# Altium schematic sheet Thermocouple channel.SchDoc
size A4
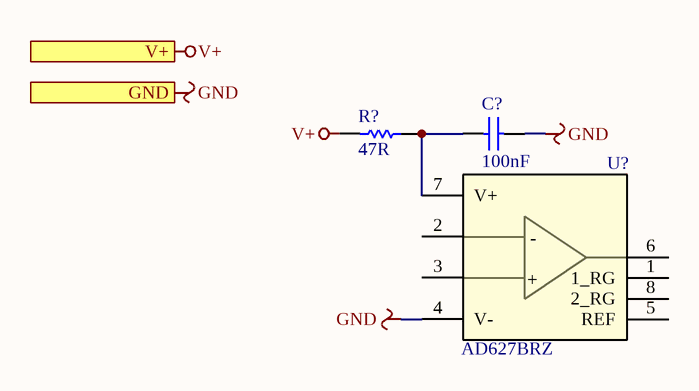
[diagram p0: Thermocouple channel.SchDoc]

## Parts
C?  100nF  [S0603C]
R?  47R  [S0603R]
U?  AD627BRZ  [SOP-8_150mil]

## Ports
GND, V+

## Nets
GND: C?.1 U?.4(V-) ; port GND
V+: R?.2 ; port V+
NetC?_2: C?.2 R?.1 U?.7(V+)

Not connected (* = marked no-connect by the designer): U? 1(1_RG) 2(VIN-) 3(VIN+) 5(REF) 6(VOUT) 8(2_RG)

## Notes on the sheet
- (in symbol AD627BRZ) +

## Library data of the parts
C? = 100nF/0603/50V: 精度 ±10% / 容值 100nF / 额定电压 50V / 温漂系数（介质材料) X7R; Manufacturer: FH(风华); A_Manufacturer: 元六; Code: 0603B104K500NT; A_Code: J CT41-0603-2R1-50V-104K; CompType: Capacitor; A_ComType: 二类电容; DistributorCode: C30926; Package: 0603
R? = 47R/0603: 精度 ±1% / 温度系数 ±100ppm/℃ / 阻值 47Ω / 功率 0.1W; Manufacturer: FH(风华); A_Manufacturer: 718; Code: RS-03K47R0FT; A_Code: J-RM1608(0603)-K-B-47R-F; CompType: Resistor; A_ComType: RM型片式膜固定电阻器; DistributorCode: C140087; Package: 0603
U? = AD627BRZ: 增益带宽积（GBP） 80kHz(-3dB) / 放大器组数 1 / 输出类型 Rail-to-Rail / 运放类型 Instrumentation / 各通道功耗 - / 压摆率（SR） 0.06 V/us / 工作温度 -40℃~85℃ / 电源电压 2.2V ~ 36V, ±1.1V ~ 18V; Manufacturer: TI(德州仪器); CompType: 运放; DistributorCode: C19137; Package: SOIC-8_150mil; Code: AD627BRZ; A_Code: -; A_Manufacturer: -; A_ComType: -